# EAGLE schematic tm4cShield_eStop_v1.0 (EAGLE 7.6.0)
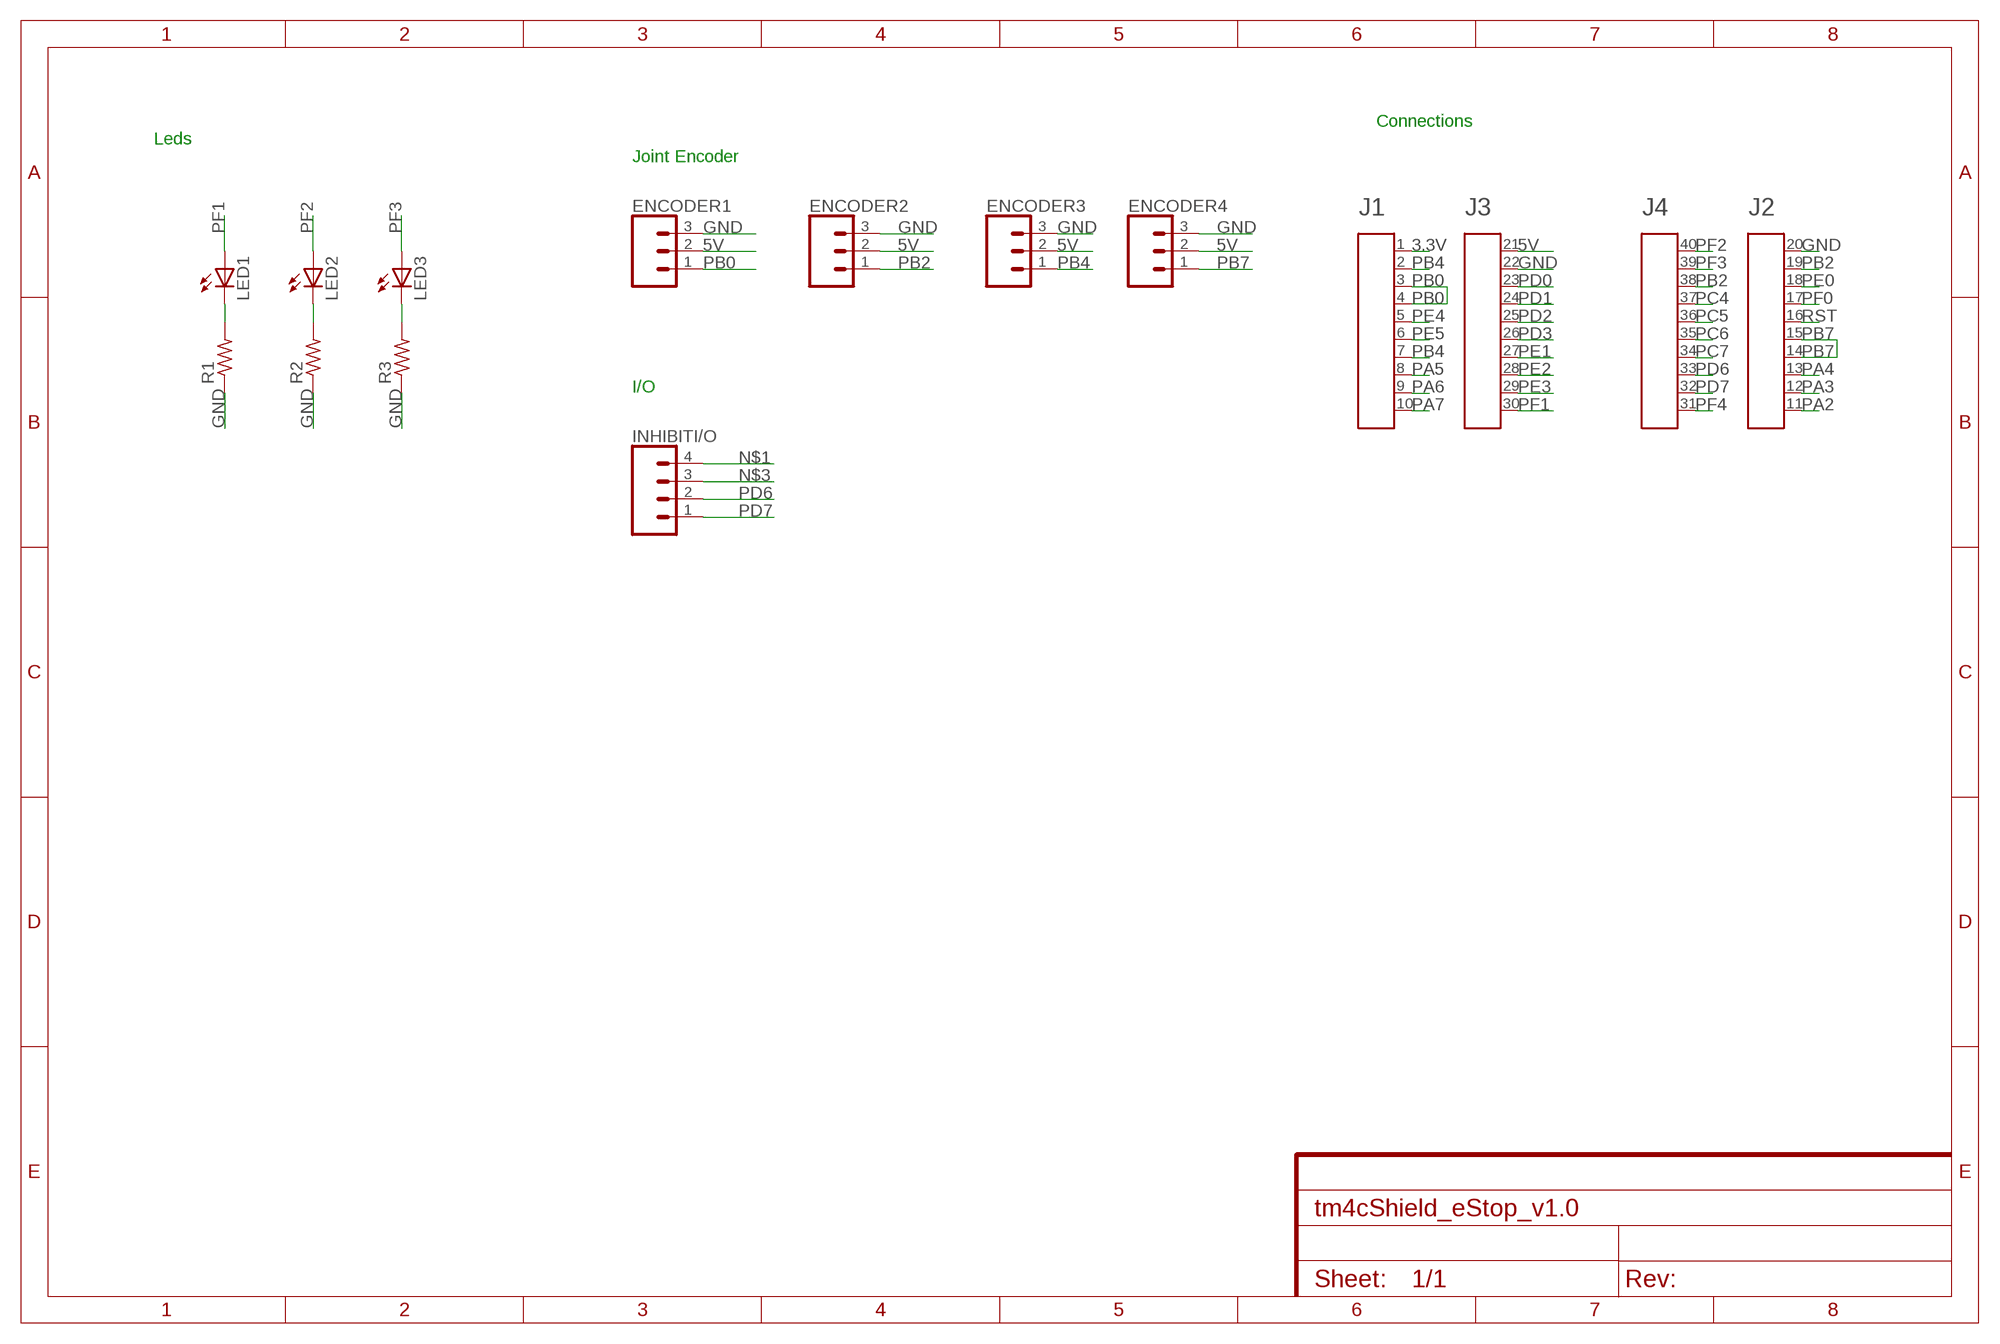
[diagram p0: schematic, sheet 1]

## Parts
A1  HEADER4X10-BOOSTERPACK  [4X10-BOOSTERPACK]
ENCODER1  CONN_03JST-PTH-VERT  [JST-3-PTH-VERT]
ENCODER2  CONN_03JST-PTH-VERT  [JST-3-PTH-VERT]
ENCODER3  CONN_03JST-PTH-VERT  [JST-3-PTH-VERT]
ENCODER4  CONN_03JST-PTH-VERT  [JST-3-PTH-VERT]
INHIBITI/O  CONN_04JST-PTH-VERT  [JST-4-PTH-VERT]
LED1  LED0603  [LED-0603]
LED2  LED0603  [LED-0603]
LED3  LED0603  [LED-0603]
R1  RESISTOR_0603  [RESC0603]
R2  RESISTOR_0603  [RESC0603]
R3  RESISTOR_0603  [RESC0603]

## Nets
3.3V: A1.1
5V: A1.21 ENCODER1.2 ENCODER2.2 ENCODER3.2 ENCODER4.2
GND: A1.20 A1.22 ENCODER1.3 ENCODER2.3 ENCODER3.3 ENCODER4.3 R1.1 R2.1 R3.1
N$1: INHIBITI/O.4
N$2: LED1.C R1.2
N$3: INHIBITI/O.3
N$6: LED2.C R2.2
N$7: LED3.C R3.2
PA2: A1.11
PA3: A1.12
PA4: A1.13
PA5: A1.8
PA6: A1.9
PA7: A1.10
PB0: A1.3 A1.4 ENCODER1.1
PB2: A1.19 A1.38 ENCODER2.1
PB4: A1.2 A1.7 ENCODER3.1
PB7: A1.14 A1.15 ENCODER4.1
PC4: A1.37
PC5: A1.36
PC6: A1.35
PC7: A1.34
PD0: A1.23
PD1: A1.24
PD2: A1.25
PD3: A1.26
PD6: A1.33 INHIBITI/O.2
PD7: A1.32 INHIBITI/O.1
PE0: A1.18
PE1: A1.27
PE2: A1.28
PE3: A1.29
PE4: A1.5
PE5: A1.6
PF0: A1.17
PF1: A1.30 LED1.A
PF2: A1.40 LED2.A
PF3: A1.39 LED3.A
PF4: A1.31
RST: A1.16

## Notes on the sheet
- Connections
- Leds
- Joint Encoder
- I/O

## Library data of the parts
A1 = EAGLE_BoosterPack_Library:HEADER4X10-BOOSTERPACK
ENCODER1-ENCODER4 = SparkFun-Connectors:CONN_03: Multi connection point. Often used as Generic Header-pin footprint for 0.1 inch spaced/style header connections On any of the 0.1 inch spaced packages, you can populate with these: Break Away Headers - Straight <https://www.sparkfun.com/products/116> (PRT-00116) Break Away Male Headers - Right Angle <https://www.sparkfun.com/products/553> (PRT-00553) Female Headers <https://www.sparkfun.com/products/115> (PRT-00115) Break Away Headers - Machine Pin <https://www.sparkfun.com/products/117> (PRT-00117) Break Away Female Headers - Swiss Machine Pin <https://www.sparkfun.com/products/743> (PRT-00743) Stackable Header - 3 Pin (Female, 0.1") <https://www.sparkfun.com/products/13875> (PRT-13875) For SCREWTERMINALS and SPRING TERMINALS visit here: Screw Terimnals on SparkFun.com <https://www.sparkfun.com/search/results?term=Screw+Terminals> (5mm/3.5mm/2.54mm spacing) This device is also useful as a general connection point to wire up your design to another part of your project. Our various solder wires solder well into these plated through hole pads. Hook-Up Wire - Assortment (Stranded, 22 AWG) <https://www.sparkfun.com/products/11375> (PRT-11375) Hook-Up Wire - Assortment (Solid Core, 22 AWG) <https://www.sparkfun.com/products/11367> (PRT-11367) View the entire wire category on our website here <https://www.sparkfun.com/categories/141> Special notes: Molex polarized connector foot print use with SKU : PRT-08232 with associated crimp pins and housings.; PROD_ID: CONN-13230
INHIBITI/O = SparkFun-Connectors:CONN_04: Multi connection point. Often used as Generic Header-pin footprint for 0.1 inch spaced/style header connections On any of the 0.1 inch spaced packages, you can populate with these: Break Away Headers - Straight <https://www.sparkfun.com/products/116> (PRT-00116) Break Away Male Headers - Right Angle <https://www.sparkfun.com/products/553> (PRT-00553) Female Headers <https://www.sparkfun.com/products/115> (PRT-00115) Break Away Headers - Machine Pin <https://www.sparkfun.com/products/117> (PRT-00117) Break Away Female Headers - Swiss Machine Pin <https://www.sparkfun.com/products/743> (PRT-00743) For SCREWTERMINALS and SPRING TERMINALS visit here: Screw Terimnals on SparkFun.com <https://www.sparkfun.com/search/results?term=Screw+Terminals> (5mm/3.5mm/2.54mm spacing) This device is also useful as a general connection point to wire up your design to another part of your project. Our various solder wires solder well into these plated through hole pads. Hook-Up Wire - Assortment (Stranded, 22 AWG) <https://www.sparkfun.com/products/11375> (PRT-11375) Hook-Up Wire - Assortment (Solid Core, 22 AWG) <https://www.sparkfun.com/products/11367> (PRT-11367) View the entire wire category on our website here <https://www.sparkfun.com/categories/141> Special notes: Molex polarized connector foot print use with SKU : PRT-08231 with associated crimp pins and housings. 1MM SMD Version SKU: PRT-10208; PROD_ID: CONN-13251
LED1-LED3 = EAGLE_BoosterPack_Library:LED: LEDs Standard schematic elements and footprints for 5mm, 3mm, 1206, and 0603 sized LEDs. 5mm - Spark Fun Electronics SKU : COM-00529 (and others)
R1-R3 = EAGLE_BoosterPack_Library:RESISTOR_